# Altium project STM32F411VET6.PrjPcb
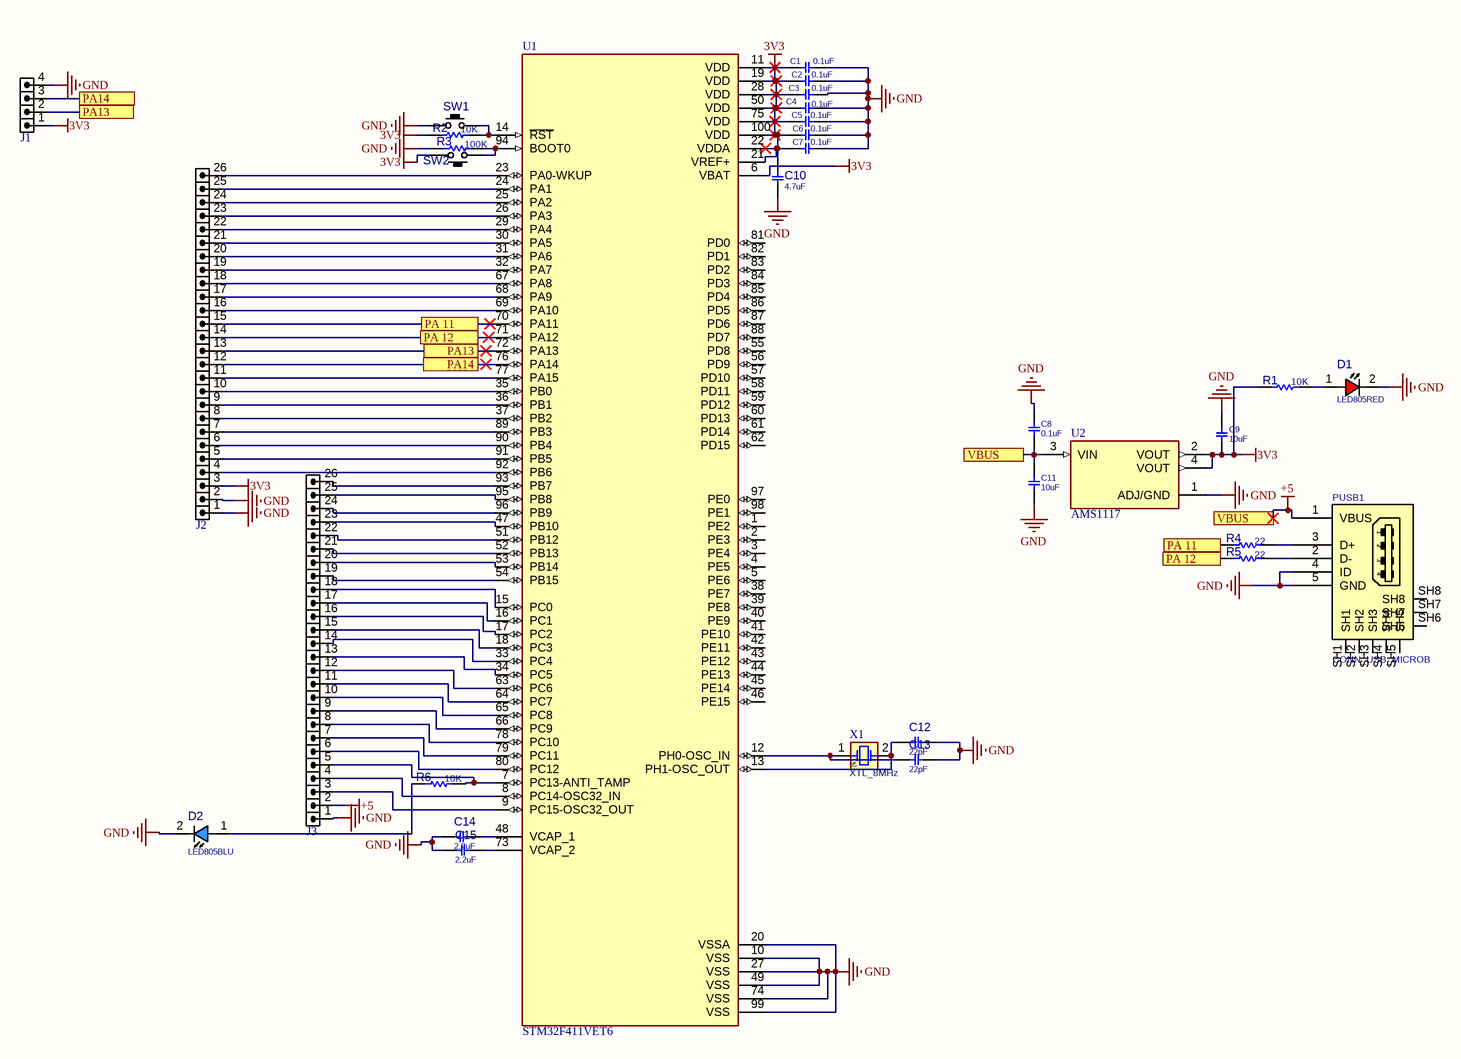
[diagram p0: Sheet1.SchDoc]
1 sheet, 32 parts. Net scope: flat (ports and power ports of the same name join across sheets).
Board file: PCB1.PcbDoc

## Sheet Sheet1.SchDoc
size 431 x 279 mm; SheetNumber: 1; SheetTotal: 1

### Parts
C1  0.1uF  [C0402]
C2  0.1uF  [C0402]
C3  0.1uF  [C0402]
C4  0.1uF  [C0402]
C5  0.1uF  [C0402]
C6  0.1uF  [C0402]
C7  0.1uF  [C0402]
C8  0.1uF  [C0402]
C9  10uF  [C0805]
C10  4.7uF  [C1206]
C11  10uF  [C0805]
C12  22pF  [C0402]
C13  22pF  [C0402]
C14  2.2uF  [C0805]
C15  2.2uF  [C0805]
D1  LED805RED  [LED0805RED]
D2  LED805BLU  [LED0805BLU]
J1  HDR1X4  [HDRR_M_1X4]  (value not drawn)
J2  HDRF26  [HDR_M_1X26]  (value not drawn)
J3  HDRF26  [HDR_M_1X26]  (value not drawn)
PUSB1  CONN_USB_MICROB  [USB_MICRO_B_BM_SHT]
R1  10K  [R0603]
R2  10K  [R0603]
R3  100K  [R0603]
R4  22  [R0603]
R5  22  [R0603]
R6  10K  [R0603]
SW1  PUSHBUTTON  [SWPBT_SPST_6X6X4]  (value not drawn)
SW2  PUSHBUTTON  [SWPBT_SPST_6X6X4]  (value not drawn)
U1  STM32F411VET6  [QFP50P1600X1600X160-100N]
U2  AMS1117  [SOT229P700X180-4N]
X1  XTL_8MHz  [XTL_2_8045]

### Ports
PA13 (see Sheet1[7E]), PA13 (see Sheet1[8F]), PA14 (see Sheet1[7E]), PA14 (see Sheet1[8F]), PA 11 (see Sheet1[4D]), PA 11 (see Sheet1[7E]), PA 12 (see Sheet1[4D]), PA 12 (see Sheet1[7E]), VBUS (see Sheet1[4D]), VBUS (see Sheet1[5E])

### Nets
3V3: C1.1 C2.1 C3.1 C4.1 C5.1 C6.1 C7.1 C9.2 C10.2 J1.1 J2.3 R1.1 R2.1 SW2.2 U1.6(VBAT) U1.11(VDD) U1.19(VDD) U1.21(VREF+) U1.22(VDDA) U1.28(VDD) U1.50(VDD) U1.75(VDD) U1.100(VDD) U2.2(VOUT) U2.4(VOUT)
+5: C8.1 C11.2 J3.2 PUSB1.1(VBUS) U2.3(VIN) ; port VBUS
GND: C1.2 C2.2 C3.2 C4.2 C5.2 C6.2 C7.2 C8.2 C9.1 C10.1 C11.1 C12.1 C13.1 C14.1 C15.1 D1.2(CATHODE) D2.2(CATHODE) J1.4 J2.1 J2.2 J3.1 PUSB1.4(ID) PUSB1.5(GND) R3.1 SW1.1 U1.10(VSS) U1.20(VSSA) U1.27(VSS) U1.49(VSS) U1.74(VSS) U1.99(VSS) U2.1(ADJ/GND)
NetC12_2: C12.2 U1.13(PH1-OSC_OUT) X1.2(OSC2)
NetC13_2: C13.2 U1.12(PH0-OSC_IN) X1.1(OSC1)
NetC14_2: C14.2 U1.48(VCAP_1)
NetC15_2: C15.2 U1.73(VCAP_2)
NetD1_1: D1.1(ANODE) R1.2
NetD2_1: D2.1(ANODE) R6.1
NetJ1_2: J1.2 J2.13 U1.72(PA13) ; port PA13
NetJ1_3: J1.3 J2.12 U1.76(PA14) ; port PA14
NetJ2_4: J2.4 U1.92(PB6)
NetJ2_5: J2.5 U1.91(PB5)
NetJ2_6: J2.6 U1.90(PB4)
NetJ2_7: J2.7 U1.89(PB3)
NetJ2_8: J2.8 U1.37(PB2)
NetJ2_9: J2.9 U1.36(PB1)
NetJ2_10: J2.10 U1.35(PB0)
NetJ2_11: J2.11 U1.77(PA15)
NetJ2_14: J2.14 R5.1 U1.71(PA12) ; port PA 12
NetJ2_15: J2.15 R4.1 U1.70(PA11) ; port PA 11
NetJ2_16: J2.16 U1.69(PA10)
NetJ2_17: J2.17 U1.68(PA9)
NetJ2_18: J2.18 U1.67(PA8)
NetJ2_19: J2.19 U1.32(PA7)
NetJ2_20: J2.20 U1.31(PA6)
NetJ2_21: J2.21 U1.30(PA5)
NetJ2_22: J2.22 U1.29(PA4)
NetJ2_23: J2.23 U1.26(PA3)
NetJ2_24: J2.24 U1.25(PA2)
NetJ2_25: J2.25 U1.24(PA1)
NetJ2_26: J2.26 U1.23(PA0-WKUP)
NetJ3_3: J3.3 U1.9(PC15-OSC32_OUT)
NetJ3_4: J3.4 U1.8(PC14-OSC32_IN)
NetJ3_5: J3.5 R6.2 U1.7(PC13-ANTI_TAMP)
NetJ3_6: J3.6 U1.80(PC12)
NetJ3_7: J3.7 U1.79(PC11)
NetJ3_8: J3.8 U1.78(PC10)
NetJ3_9: J3.9 U1.66(PC9)
NetJ3_10: J3.10 U1.65(PC8)
NetJ3_11: J3.11 U1.64(PC7)
NetJ3_12: J3.12 U1.63(PC6)
NetJ3_13: J3.13 U1.34(PC5)
NetJ3_14: J3.14 U1.33(PC4)
NetJ3_15: J3.15 U1.18(PC3)
NetJ3_16: J3.16 U1.17(PC2)
NetJ3_17: J3.17 U1.16(PC1)
NetJ3_18: J3.18 U1.15(PC0)
NetJ3_19: J3.19 U1.54(PB15)
NetJ3_20: J3.20 U1.53(PB14)
NetJ3_21: J3.21 U1.52(PB13)
NetJ3_22: J3.22 U1.51(PB12)
NetJ3_23: J3.23 U1.47(PB10)
NetJ3_24: J3.24 U1.96(PB9)
NetJ3_25: J3.25 U1.95(PB8)
NetJ3_26: J3.26 U1.93(PB7)
NetPUSB1_2: PUSB1.2(D-) R5.2
NetPUSB1_3: PUSB1.3(D+) R4.2
NetR2_2: R2.2 SW1.2 U1.14(~{RST})
NetR3_2: R3.2 SW2.1 U1.94(BOOT0)

Not connected (* = marked no-connect by the designer): PUSB1 SH1 SH2 SH3 SH4 SH5 SH6 SH7 SH8; U1 1(PE2) 2(PE3) 3(PE4) 4(PE5) 5(PE6) 38(PE7) 39(PE8) 40(PE9) 41(PE10) 42(PE11) 43(PE12) 44(PE13) 45(PE14) 46(PE15) 55(PD8) 56(PD9) 57(PD10) 58(PD11) 59(PD12) 60(PD13) 61(PD14) 62(PD15) 81(PD0) 82(PD1) 83(PD2) 84(PD3) 85(PD4) 86(PD5) 87(PD6) 88(PD7) 97(PE0) 98(PE1)

### Notes on the sheet
- DWG. NO.
- REV.
- SHT.
- THIS DOCUMENT AND THE DATA DISCLOSED HEREIN OR HEREWITH IS THE PROPERTY OF ALTIUM LIMITED AND MAY BE FREELY DISTRIBUTED IN WHOLE. NO RIGHTS ARE RESERVED OR EXPRESS OR IMPLIED WARANTEE GIVEN.
- REVISION
- DESCRIPTION
- DATE
- APPROVED
- ENG:
- APPROVALS
- PROJECT
- DSN:
- CHK:
- REFERENCE DOCUMENTS
- PROJECT REVISION:
- TITLE
- DOCUMENT REVISION:
- DESIGN ITEM:
- BOM:
- FAB DWG:
- PCB DWG:
- ASSY DWG:
- SCALE:
- SIZE
- B
- CAGE CODE
- FILE NAME
- DWG NO.
- SHEET
- OF
- REV

### Library data of the parts
C1-C8 = CAP_SMD_MLCC_100n50T: CAP, MLCC, 100nF, 50V, X5R, 10%, 0402C; PARAM: X5R, 10%, -55~85oC; MANF_P#: UMK105BJ104KV-F; MANF: Taiyo Yuden; PARAM2: 50V; ASSEMBLY: ASSEMBLY; PRICE: 100= 3.8$; VALUE: 0.1uF
C9 C11 = CAP_SMD_MLCC_10u25V: CAP, MLCC, X5R 10uF 10% 25V 0805; MANF_P#: TMK212BBJ106MG; MANF: Taiyo Yuden; PARAM: X5R, 10%; PARAM2: 25V; PRICE: 100=6$; VALUE: 10uF
C10 = CAP_SMD_MLCC_4.7u50V: CAP, MLCC, SMD; MANF_P#: UMK316BJ475KL-T; MANF: Taiyo Yuden; PARAM: X5R, 20%; DIST#: MOUSER; PARAM2: 50V; ASSEMBLY: ASSEMBLY; PRICE: 0.4$; DESC: CAP, MLCC; VALUE: 4.7uF
C12 C13 = CAP_SMD_MLCC_22p50V: CAP, MLCC, 50V, C0G, 2%; MANF_P#: GRM1555C1H220GA01D; MANF: MURATA; PARAM: C0G, 2%; DIST#: MOUSER; ASSEMBLY: ASSEMBLY; PRICE: 100= 2.4$; DESC: CAP, MLCC; PARAM2: 50V; VALUE: 22pF
C14 C15 = CAP_SMD_MLCC_2.2u50V_0805: CAP, MLCC; MANF_P#: UMK212ABJ225KG-T; MANF: Taiyo Yuden; PARAM: X5R, 10%; DIST#: MOUSER; PARAM2: 50V; ASSEMBLY: ASSEMBLY; PRICE: 100= 10$; DESC: CAP, MLCC; VALUE: 2.2uF
D1 = LED_SMD_0805_RED: LED, SMD, 0805, RED; DESC: DESCRIPTION; MANF_P#: MANF_PART#; PARAM2: 2.2V; MANF: MANF; ASSEMBLY: ASSEMBLY; PRICE: 36t@Javan; VALUE: LED805RED
D2 = LED_SMD_0805_BLU: LED, SMD, 0805, BLUE; DESC: DESCRIPTION; MANF_P#: MANF_PART#; PARAM2: 2.2V; MANF: MANF; ASSEMBLY: ASSEMBLY; PRICE: 36t@Javan; VALUE: LED805BLU
J1 = HDRR_M_1X4: CONN, HEADER, RightAngle, Male, pitch: 2.54mm, 4POS; VALUE: HDRM4
J2 J3 = HDR_M_1X26: CONN, HEADER, Male, pitch: 2.54mm, 26POS; VALUE: HDRF26
PUSB1 = CONN_USB_MICRO_B_BM_SHT: CONN, USB, MICRO B, R/A, SMD, BOTTOM MOUNT, SHT; MANF_P#: -; MANF: -; VALUE: CONN_USB_MICROB
R1-R6 = RES_SMD_0603: RESISTOR, SMD; PARAM: 1%, 0.1W; DESC: DESCRIPTION; DIST#: MOUSER; MANF_P#: -; MANF: -; ASSEMBLY: ASSEMBLY; PRICE: -; PARAM2: -
  R1 R2 R6: VALUE: 10K
  R3: VALUE: 100K
  R4 R5: VALUE: 22
SW1 SW2 = SWPBT_SPST_6X6X4: SWITCH, PUSH BUTTON, TACTILE, THD, SPST, 6X6X4mm; DESC: DESCRIPTION; MANF: -; VALUE: PUSHBUTTON; ASSEMBLY: ASSEMBLY; PARAM: PARAM; PRICE: PRICE; MANF_P#: -
U1 = STM32F411VET6: Mcu, 32Bit, 100Mhz, Lqfp-100; Product Range:Stm32 Family Stm32F4 Series Microcontrollers; Device Core:Arm Cortex-M4; Data Bus Width:32 Bit; Operating Frequency Max:100Mhz; Program Memory Size:512Kb; No. Of Pins:100Pins Rohs Compliant: Yes |Stmicroelectron; MF: STMicroelectronics; MP: STM32F411VET6.; SnapEDA_Link: https://www.snapeda.com/parts/STM32F411VET6./STMicroelectronics/view-part/?ref=snap; Package: None; Value: *; Check_prices: https://www.snapeda.com/parts/STM32F411VET6./STMicroelectronics/view-part/?ref=eda
U2 = AMS1117: 1A LOW DROPOUT VOLTAGE REGULATOR SOT-223; MF: Advanced Monolithic Systems; SnapEDA_Link: https://www.snapeda.com/parts/AMS1117/Advanced+Monolithic+Systems/view-part/?ref=snap; Package: SOT-223 Seeed Technology; Value: *; MP: AMS1117; Check_prices: https://www.snapeda.com/parts/AMS1117/Advanced+Monolithic+Systems/view-part/?ref=eda
X1 = XTL_2_8MHz_ABM2: Crystal 2; MANF: ABRACON; PARAM: 30PPM; PARAM2: 18PF; MANF_P#: ABM2-8.000MHZ-D4Y-T; ASSEMBLY: ASSEMBLY; PRICE: 0.73$; Value: XTL_8MHz